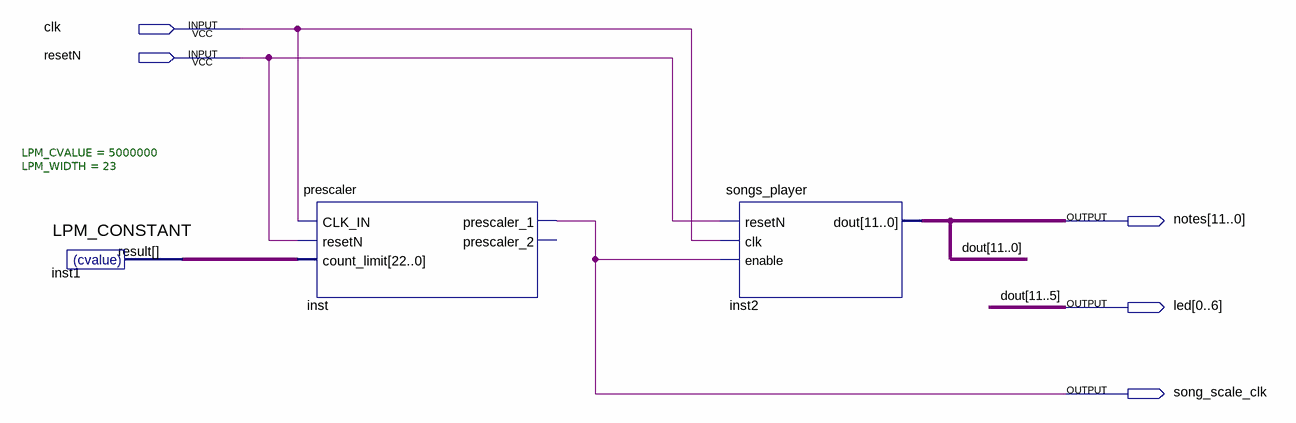
[diagram p0: schematic sheet]
// Quartus schematic song_manager.bdf as structural Verilog: 3 symbols, 5 pins
module song_manager (
  input  clk,
  input  resetN,
  output [11:0] notes,
  output [0:6] led,
  output song_scale_clk
);

  wire [22:0] inst1_result;

  LPM_CONSTANT #(.LPM_CVALUE(5000000), .LPM_WIDTH(23)) inst1 (.result(inst1_result));
  prescaler inst (
    .CLK_IN(clk), .resetN(resetN), .count_limit(inst1_result), .prescaler_1(song_scale_clk));  // open: prescaler_2
  songs_player inst2 (.resetN(resetN), .clk(clk), .enable(song_scale_clk), .dout({led, notes[4:0]}));

  assign notes[11:5] = led;

  // Other names for the same wires on the sheet: dout[11:0] = {led, notes[4:0]}
endmodule
